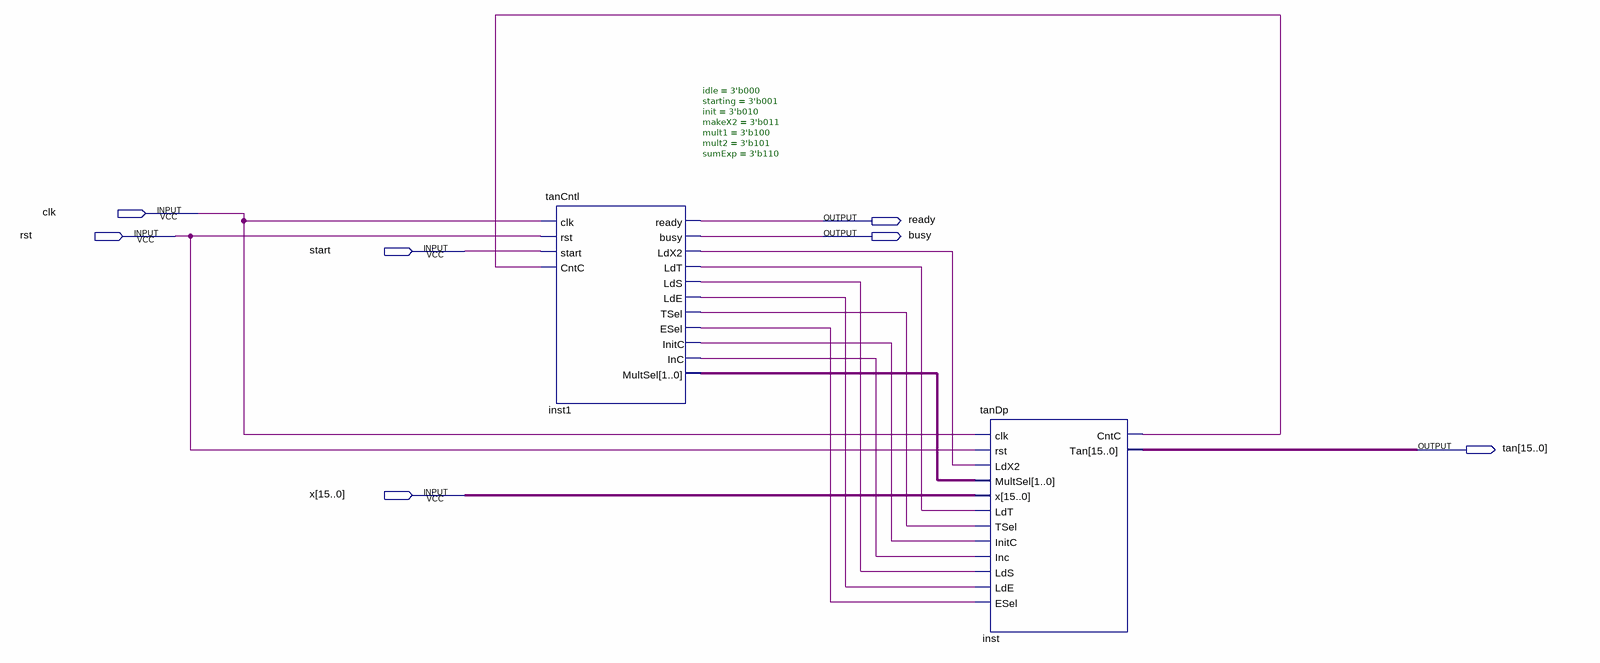
[diagram p0: schematic sheet]
// Quartus schematic TanX.bdf as structural Verilog: 2 symbols, 7 pins
module TanX (
  input  clk,
  input  rst,
  input  start,
  input  [15:0] x,
  output ready,
  output busy,
  output [15:0] tan
);

  wire inst1_esel, inst1_inc, inst1_initc, inst1_lde, inst1_lds, inst1_ldt, inst1_ldx2, inst1_tsel, inst_cntc;
  wire [1:0] inst1_multsel;

  tanCntl #(.idle(3'b000), .starting(3'b001), .init(3'b010), .makeX2(3'b011), .mult1(3'b100), .mult2(3'b101), .sumExp(3'b110)) inst1 (
    .clk(clk), .rst(rst), .start(start), .CntC(inst_cntc), .ready(ready), .busy(busy), .LdX2(inst1_ldx2),
    .LdT(inst1_ldt), .LdS(inst1_lds), .LdE(inst1_lde), .TSel(inst1_tsel), .ESel(inst1_esel),
    .InitC(inst1_initc), .InC(inst1_inc), .MultSel(inst1_multsel));
  tanDp inst (
    .clk(clk), .rst(rst), .LdX2(inst1_ldx2), .MultSel(inst1_multsel), .x(x), .LdT(inst1_ldt),
    .TSel(inst1_tsel), .InitC(inst1_initc), .Inc(inst1_inc), .LdS(inst1_lds), .LdE(inst1_lde),
    .ESel(inst1_esel), .CntC(inst_cntc), .Tan(tan));
endmodule
